# EAGLE board stream_i-o_2_2 (EAGLE 7.5.0), part 1 of 2
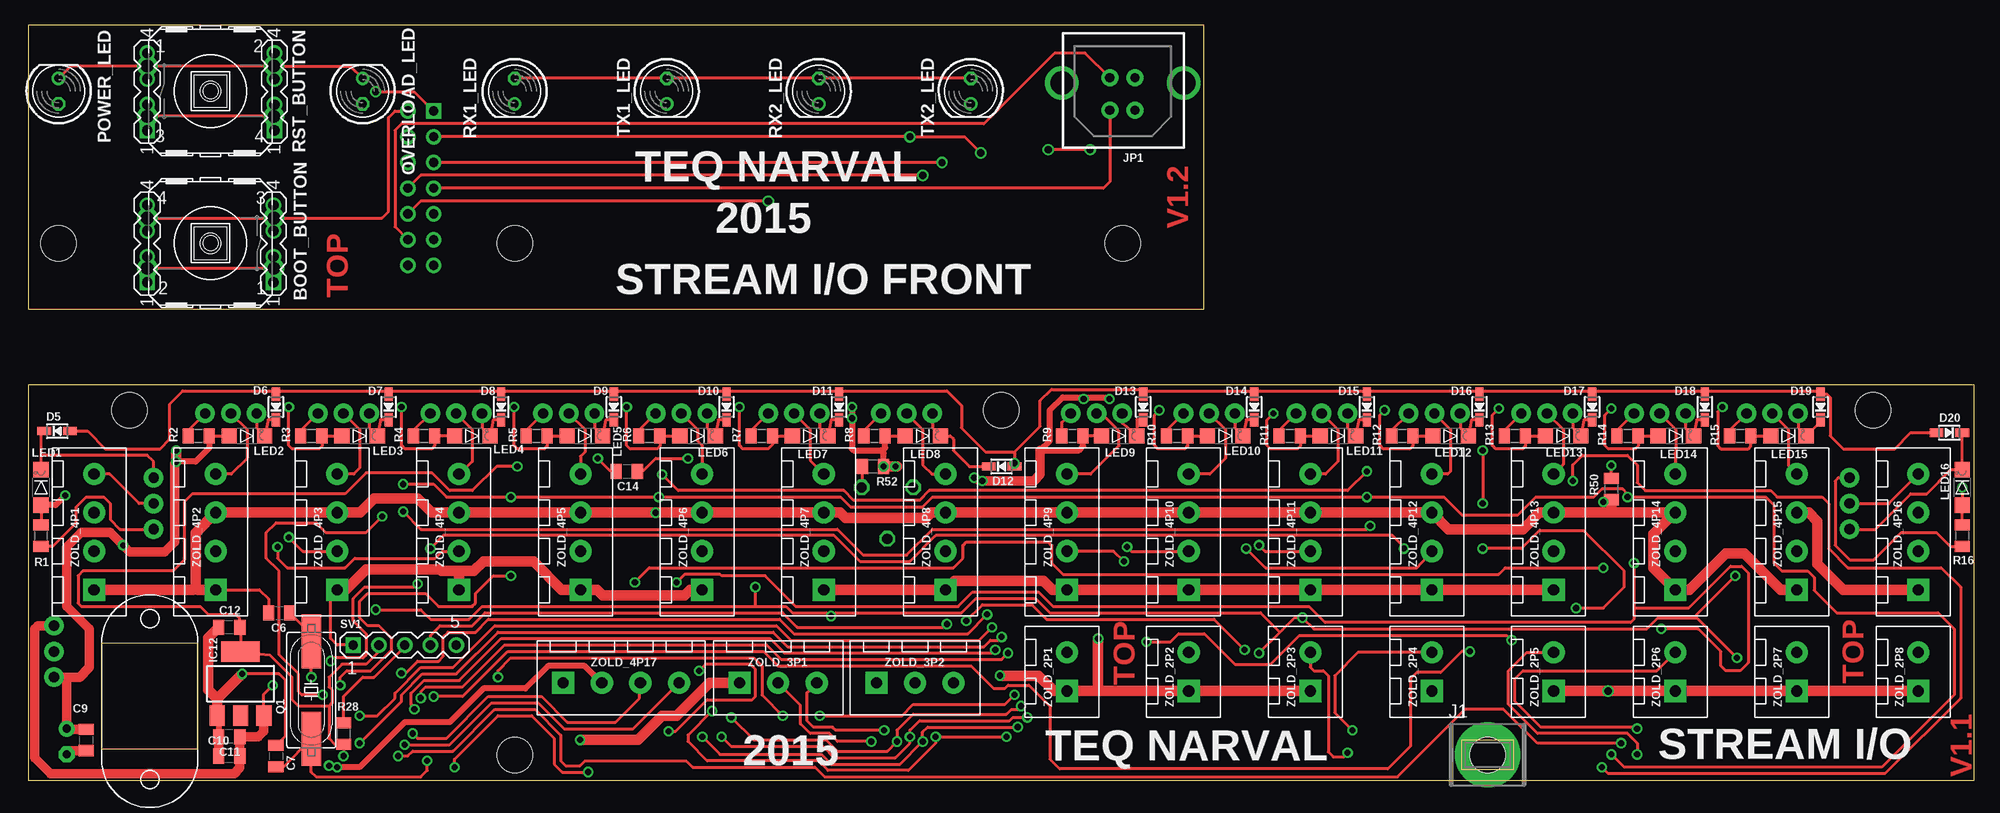
[diagram p3: board, top side]
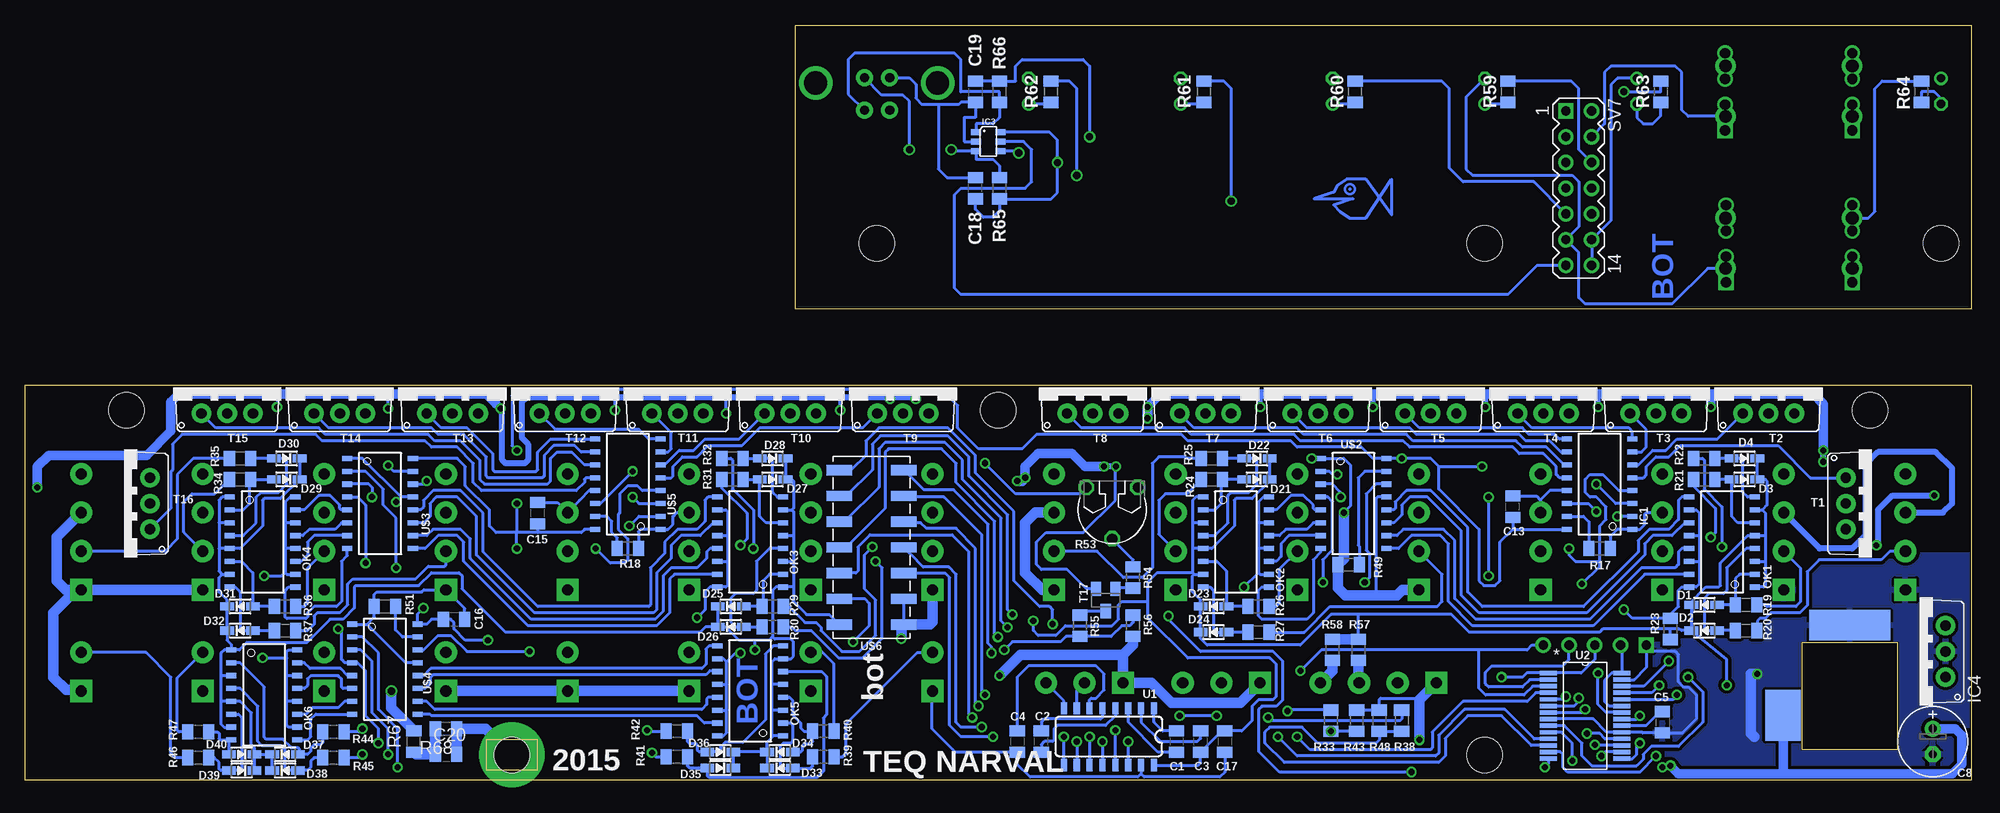
[diagram p4: board, bottom side, seen from below]

Size 192 x 74.5 mm. Coordinates in mm from the lower left corner, seen from the top.
Outline: 0,0 192,0 192,39 0,39 0,0
Outline: 0,46.5 116,46.5 116,74.5 0,74.5 0,46.5
Copper layers (1*16): Top 0.035mm / dielectric 1.5mm / Bottom 0.035mm
Design rules "10mil *": minimum track width 10mil, minimum drill 24mil, track to track 10mil, track to pad 10mil, pad to pad 10mil, via to via 10mil, smd to smd 10mil, copper to edge 5mil, drill to drill 5mil, minimum pad ring 10mil, minimum via ring 8mil, stop-mask expansion 4mil, vias tented up to drill 0mil, thermal gap 10mil
Net classes: 0 default: width 0.305 mm, clearance 0.305 mm
Holes 3.5 mm at 10,36.5 96,36.5 182,36.5 48,2.5 144,2.5 48,53 108,53 3,53

## Footprints (pad centres in the part's own frame; a part is rotated, then mirrored left to right if it is on the bottom)
RACON12 = drill 1.27 pad 2.032: 1 -6.248,2.489; 2 6.248,2.489; 3 -6.248,-2.489; 4 6.248,-2.489
C0805 = smd 1.1 x 1.5: 1 -1.05,0; 2 1.05,0
E2,5-7 = drill 0.813 pad 1.6: + -1.27,0 | drill 0.813 pad 1.6 octagon: - 1.27,0
SOD-323 = smd 1.35 x 0.8: A 1.27,0; C -1.27,0
DC_55/21 = smd 8 x 3 bottom: 1 0,6.985 | smd 3.5 x 5 bottom: 2 6.565,-1.905
SOP16 = smd 1 x 0.5: 1 -3.24,4.445; 2 -3.24,3.175; 3 -3.24,1.905; 4 -3.24,0.635; 5 -3.24,-0.635; 6 -3.24,-1.905; 7 -3.24,-3.175; 8 -3.24,-4.445; 9 3.24,-4.445; 10 3.24,-3.175; 11 3.24,-1.905; 12 3.24,-0.635; 13 3.24,0.635; 14 3.24,1.905; 15 3.24,3.175; 16 3.24,4.445
TSOP-6 = smd 0.6 x 1: 1 -0.95,-1.2; 2 0,-1.2; 3 0.95,-1.2; 4 0.95,1.2; 5 0,1.2; 6 -0.95,1.2
TO220V = drill 1.016 pad 1.93: 1 -2.54,-2.54; 2 0,-2.54; 3 2.54,-2.54
SOT223 = smd 1.5 x 2: 1 -2.3,-3.15; 2 0,-3.15; 3 2.3,-3.15 | smd 3.8 x 2: 4 0,3.15
62221 = drill 3.5 pad 6.452: 1 0,0
USB-B-PTH-VERTICAL = drill 0.914 pad 1.676: D+ -1.206,-1.321; D- -1.206,1.88; GND 1.283,-1.321; VBUS 1.283,1.88 | drill 2.286: P$1 -6.032,-0.813; P$2 6.007,-0.813
CHIPLED_1206 = smd 1.5 x 1.5: A 0,-1.75; C 0,1.75
MINI-FLAT-16 = smd 1 x 0.5: 1 -3.24,4.445; 2 -3.24,3.175; 3 -3.24,1.905; 4 -3.24,0.635; 5 -3.24,-0.635; 6 -3.24,-1.905; 7 -3.24,-3.175; 8 -3.24,-4.445; 9 3.24,-4.445; 10 3.24,-3.175; 11 3.24,-1.905; 12 3.24,-0.635; 13 3.24,0.635; 14 3.24,1.905; 15 3.24,3.175; 16 3.24,4.445
LED5MM = drill 0.813 octagon: A -1.27,0 | drill 0.813: K 1.27,0
HC49UP = smd 5.334 x 1.93: 1 -4.826,0; 2 4.826,0
R0805 = smd 1.1 x 1.5: 1 -1.05,0; 2 1.05,0
PT-6 = drill 1.016 octagon: A -2.54,-5.08; E 2.54,-5.08; S 0,0
MA05-1 = drill 0.914 pad 1.524 square: 1 -5.08,0 | drill 0.914 pad 1.524: 2 -2.54,0; 3 0,0; 4 2.54,0; 5 5.08,0
MA04-1 = drill 1.016 square: 1 -3.81,0 | drill 1.016: 2 -1.27,0; 3 1.27,0; 4 3.81,0
MA07-2 = drill 0.914 pad 1.524 square: 1 -7.62,-1.27 | drill 0.914 pad 1.524: 2 -7.62,1.27; 3 -5.08,-1.27; 4 -5.08,1.27; 5 -2.54,-1.27; 6 -2.54,1.27; 7 0,-1.27; 8 0,1.27; 9 2.54,-1.27; 10 2.54,1.27; 11 5.08,-1.27; 12 5.08,1.27; 13 7.62,-1.27; 14 7.62,1.27
SOT23-BEC = smd 1 x 1.4: B -0.95,-1.1; C 0,1.1; E 0.95,-1.1
SO016 = smd 0.6 x 1.2: 1 -4.445,-2.8; 2 -3.175,-2.8; 3 -1.905,-2.8; 4 -0.635,-2.8; 5 0.635,-2.8; 6 1.905,-2.8; 7 3.175,-2.8; 8 4.445,-2.8; 9 4.445,2.8; 10 3.175,2.8; 11 1.905,2.8; 12 0.635,2.8; 13 -0.635,2.8; 14 -1.905,2.8; 15 -3.175,2.8; 16 -4.445,2.8
SSOP28_MC = smd 1.676 x 0.432: 1 -3.617,4.225; 2 -3.617,3.575; 3 -3.617,2.925; 4 -3.617,2.275; 5 -3.617,1.625; 6 -3.617,0.975; 7 -3.617,0.325; 8 -3.617,-0.325; 9 -3.617,-0.975; 10 -3.617,-1.625; 11 -3.617,-2.275; 12 -3.617,-2.925; 13 -3.617,-3.575; 14 -3.617,-4.225; 15 3.617,-4.225; 16 3.617,-3.575; 17 3.617,-2.925; 18 3.617,-2.275; 19 3.617,-1.625; 20 3.617,-0.975; 21 3.617,-0.325; 22 3.617,0.325; 23 3.617,0.975; 24 3.617,1.625; 25 3.617,2.275; 26 3.617,2.925; 27 3.617,3.575; 28 3.617,4.225
PIN_HEADER_2X7 = smd 1.016 x 2.54: 1A -7.62,3.175; 1B -7.62,-3.175; 2A -5.08,3.175; 2B -5.08,-3.175; 3A -2.54,3.175; 3B -2.54,-3.175; 4A 0,3.175; 4B 0,-3.175; 5A 2.54,3.175; 5B 2.54,-3.175; 6A 5.08,3.175; 6B 5.08,-3.175; 7A 7.62,3.175; 7B 7.62,-3.175
ZOLD_KICSI_2P = drill 1.1 pad 2.184 square: 1 -1.905,-0.5 | drill 1.1 pad 2.184: 2 1.905,-0.5
ZOLD_KICSI_3P = drill 1.1 pad 2.184 square: 1 -3.81,-0.5 | drill 1.1 pad 2.184: 2 0,-0.5; 3 3.81,-0.5
ZOLD_KICSI_4P = drill 1.1 pad 2.184 square: 1 -5.715,-0.5 | drill 1.1 pad 2.184: 2 -1.905,-0.5; 3 1.905,-0.5; 4 5.715,-0.5

## Placement (x,y rotation side)
BOOT_BUTTON  BUTTONRACON12  [RACON12]  18,53 180 top
C1  1u  [C0805]  78.42,3.81 270 bottom
C2  1u  [C0805]  91.76,3.81 90 bottom
C3  1u  [C0805]  76.04,3.81 90 bottom
C4  1u  [C0805]  94.14,3.81 270 bottom
C5  10u  [C0805]  30.48,5.71 270 bottom
C6  22p  [C0805]  24.77,16.51 0 top
C7  22p  [C0805]  24.45,2.38 270 top
C8  220u  [E2,5-7]  3.81,3.81 270 bottom
C9  100n  [C0805]  5.71,3.97 270 top
C10  10u  [C0805]  19.84,2.38 180 top
C11  10u  [C0805]  19.84,4.29 180 top
C12  10u  [C0805]  19.84,15.08 180 top
C13  100n  [C0805]  45.24,26.99 90 bottom
C14  100n  [C0805]  59.05,30.48 0 top
C15  100n  [C0805]  141.45,26.35 90 bottom
C16  100n  [C0805]  149.7,15.88 0 bottom
C17  100n  [C0805]  73.66,3.81 270 bottom
C18  47p  [C0805]  98.27,58.42 90 bottom
C19  47p  [C0805]  98.27,67.94 270 bottom
C20  100n  [C0805]  150.5,2.54 0 bottom
D1  1N4148  [SOD-323]  26.35,17.3 0 bottom
D2  1N4148  [SOD-323]  26.35,14.76 0 bottom
D3  1N4148  [SOD-323]  22.38,29.69 180 bottom
D4  1N4148  [SOD-323]  22.38,31.75 180 bottom
D5  1N4148  [SOD-323]  2.86,34.45 0 top
D6  1N4148  [SOD-323]  24.45,36.83 90 top
D7  1N4148  [SOD-323]  35.56,36.83 90 top
D8  1N4148  [SOD-323]  46.67,36.83 90 top
D9  1N4148  [SOD-323]  57.78,36.83 90 top
D10  1N4148  [SOD-323]  68.9,36.83 90 top
D11  1N4148  [SOD-323]  80.01,36.83 90 top
D12  1N4148  [SOD-323]  96.04,30.96 0 top
D13  1N4148  [SOD-323]  110.01,36.83 90 top
D14  1N4148  [SOD-323]  120.97,36.83 90 top
D15  1N4148  [SOD-323]  132.08,36.83 90 top
D16  1N4148  [SOD-323]  143.19,36.83 90 top
D17  1N4148  [SOD-323]  154.31,36.83 90 top
D18  1N4148  [SOD-323]  165.42,36.83 90 top
D19  1N4148  [SOD-323]  176.85,36.83 90 top
D20  1N4148  [SOD-323]  189.55,34.29 180 top
D21  1N4148  [SOD-323]  70.48,29.69 180 bottom
D22  1N4148  [SOD-323]  70.48,31.75 180 bottom
D23  1N4148  [SOD-323]  74.77,17.14 0 bottom
D24  1N4148  [SOD-323]  74.77,14.61 0 bottom
D25  1N4148  [SOD-323]  122.4,17.14 0 bottom
D26  1N4148  [SOD-323]  122.4,15.12 0 bottom
D27  1N4148  [SOD-323]  118.27,29.69 180 bottom
D28  1N4148  [SOD-323]  118.27,31.75 180 bottom
D29  1N4148  [SOD-323]  166.21,29.69 180 bottom
D30  1N4148  [SOD-323]  166.21,31.75 180 bottom
D31  1N4148  [SOD-323]  170.81,17.14 0 bottom
D32  1N4148  [SOD-323]  170.81,14.76 0 bottom
D33  1N4148  [SOD-323]  117.55,1.19 0 bottom
D34  1N4148  [SOD-323]  117.55,2.78 0 bottom
D35  1N4148  [SOD-323]  123.43,1.19 180 bottom
D36  1N4148  [SOD-323]  123.43,2.78 180 bottom
D37  1N4148  [SOD-323]  166.37,2.54 0 bottom
D38  1N4148  [SOD-323]  166.37,0.95 0 bottom
D39  1N4148  [SOD-323]  170.66,0.95 180 bottom
D40  1N4148  [SOD-323]  170.66,2.54 180 bottom
DC1  DC_55/21  [DC_55/21]  12,8.3 0 top
IC1  SCT21SOP16  [SOP16]  36.67,29.21 180 bottom
IC3  BEM_VEDO  [TSOP-6]  97,63.02 270 bottom
IC4  7805TV  [TO220V]  5.08,12.7 90 bottom
IC12  LD117AS33TR  [SOT223]  20.95,9.53 0 top
J1  PIN1-2  [62221]  144,2.5 0 top
JP1  USBPTH-VERTICAL  [USB-B-PTH-VERTICAL]  108,68 180 top
LED1  RED  [CHIPLED_1206]  1.27,28.89 0 top
LED2  RED  [CHIPLED_1206]  21.59,33.97 270 top
LED3  RED  [CHIPLED_1206]  32.7,33.97 270 top
LED4  RED  [CHIPLED_1206]  43.81,33.97 270 top
LED5  RED  [CHIPLED_1206]  54.93,33.97 270 top
LED6  RED  [CHIPLED_1206]  66.04,33.97 270 top
LED7  RED  [CHIPLED_1206]  77.15,33.97 270 top
LED8  RED  [CHIPLED_1206]  88.27,33.97 270 top
LED9  RED  [CHIPLED_1206]  107.63,33.97 270 top
LED10  RED  [CHIPLED_1206]  118.11,33.97 270 top
LED11  RED  [CHIPLED_1206]  129.22,33.97 270 top
LED12  RED  [CHIPLED_1206]  140.34,33.97 270 top
LED13  RED  [CHIPLED_1206]  151.45,33.97 270 top
LED14  RED  [CHIPLED_1206]  162.56,33.97 270 top
LED15  RED  [CHIPLED_1206]  173.67,33.97 270 top
LED16  RED  [CHIPLED_1206]  190.82,28.89 0 top
OK1  TLP281-4  [MINI-FLAT-16]  24.61,23.5 180 bottom
OK2  TLP281-4  [MINI-FLAT-16]  72.55,23.5 0 bottom
OK3  TLP281-4  [MINI-FLAT-16]  120.49,23.5 180 bottom
OK4  TLP281-4  [MINI-FLAT-16]  168.59,23.5 0 bottom
OK5  TLP281-4  [MINI-FLAT-16]  120.49,8.81 180 bottom
OK6  TLP281-4  [MINI-FLAT-16]  168.43,8.41 0 bottom
OVERLOAD_LED  RED  [LED5MM]  33,68 90 top
POWER_LED  KEK  [LED5MM]  3,68 90 top
Q1  20MHz  [HC49UP]  27.94,8.89 90 top
R1  6R8  [R0805]  1.27,24.13 90 top
R2  6R8  [R0805]  16.83,33.97 0 top
R3  6R8  [R0805]  27.94,33.97 0 top
R4  6R8  [R0805]  39.05,33.97 0 top
R5  6R8  [R0805]  50.16,33.97 0 top
R6  6R8  [R0805]  61.28,33.97 0 top
R7  6R8  [R0805]  72.39,33.97 0 top
R8  6R8  [R0805]  83.5,33.97 0 top
R9  6R8  [R0805]  103.03,33.97 0 top
R10  6R8  [R0805]  113.35,33.97 0 top
R11  6R8  [R0805]  124.46,33.97 0 top
R12  6R8  [R0805]  135.57,33.97 0 top
R13  6R8  [R0805]  146.69,33.97 0 top
R14  6R8  [R0805]  157.8,33.97 0 top
R15  6R8  [R0805]  168.91,33.97 0 top
R16  6R8  [R0805]  190.82,24.13 90 top
R17  10k  [R0805]  36.67,22.86 180 bottom
R18  10k  [R0805]  132.56,22.86 180 bottom
R19  2k2  [R0805]  22.23,17.3 180 bottom
R20  2k2  [R0805]  22.23,14.76 180 bottom
R21  2k2  [R0805]  26.35,29.69 0 bottom
R22  2k2  [R0805]  26.35,31.75 0 bottom
R23  1k  [R0805]  29.69,14.92 270 bottom
R24  2k2  [R0805]  74.93,29.69 0 bottom
R25  2k2  [R0805]  74.93,31.75 0 bottom
R26  2k2  [R0805]  70.33,17.14 180 bottom
R27  2k2  [R0805]  70.33,14.61 180 bottom
R28  1k  [R0805]  31.11,4.6 270 top
R29  2k2  [R0805]  118.27,17.14 180 bottom
R30  2k2  [R0805]  118.27,15.12 180 bottom
R31  2k2  [R0805]  122.24,29.69 0 bottom
R32  2k2  [R0805]  122.24,31.75 0 bottom
R33  1k  [R0805]  63.18,5.87 90 bottom
R34  2k2  [R0805]  170.81,29.69 0 bottom
R35  2k2  [R0805]  170.81,31.75 0 bottom
R36  2k2  [R0805]  166.37,17.14 180 bottom
R37  2k2  [R0805]  166.37,14.76 180 bottom
R38  1k  [R0805]  56.2,5.87 90 bottom
R39  2k2  [R0805]  113.27,2.3 180 bottom
R40  2k2  [R0805]  113.27,4.84 180 bottom
R41  2k2  [R0805]  127.71,2.3 0 bottom
R42  2k2  [R0805]  127.71,4.84 0 bottom
R43  2k2  [R0805]  60.64,5.87 270 bottom
R44  2k2  [R0805]  161.61,4.76 180 bottom
R45  2k2  [R0805]  161.61,2.22 180 bottom
R46  2k2  [R0805]  174.94,2.22 0 bottom
R47  2k2  [R0805]  174.94,4.76 0 bottom
R48  2k2  [R0805]  58.42,5.87 270 bottom
R49  2k2  [R0805]  61.44,21.27 0 bottom
R50  2k2  [R0805]  156.21,28.73 90 top
R51  2k2  [R0805]  156.53,17.14 0 bottom
R52  4k7  [R0805]  83.34,30.96 0 top
R53  10k  [PT-6]  84.77,23.81 180 bottom
R54  10k  [R0805]  82.71,20 90 bottom
R55  10k  [R0805]  87.95,15.24 90 bottom
R56  3k3  [R0805]  82.71,15.24 90 bottom
R57  4k7  [R0805]  60.48,12.86 90 bottom
R58  4k7  [R0805]  63.02,12.86 90 bottom
R59  470  [R0805]  45.72,67.94 90 bottom
R60  2k2  [R0805]  60.8,67.94 90 bottom
R61  470  [R0805]  75.72,67.94 90 bottom
R62  2k2  [R0805]  90.81,67.94 90 bottom
R63  1k  [R0805]  30.64,67.94 90 bottom
R64  1k  [R0805]  4.92,67.94 90 bottom
R65  33  [R0805]  95.89,58.42 270 bottom
R66  33  [R0805]  95.89,67.94 90 bottom
R67  100  [R0805]  153.67,3.81 90 bottom
R68  10k  [R0805]  150.5,5.08 180 bottom
RST_BUTTON  BUTTONRACON12  [RACON12]  18,68 0 top
RX1_LED  ORANGE  [LED5MM]  48,68 270 top
RX2_LED  ORANGE  [LED5MM]  78,68 270 top
SV1  PROG  [MA05-1]  37.15,13.34 0 top
SV3  [MA04-1]  11.75,67.94 90 top
SV4  [MA04-1]  24.29,67.94 90 top
SV5  [MA04-1]  11.75,52.94 90 top
SV6  [MA04-1]  24.21,52.94 90 top
SV7  [MA07-2]  38.73,58.42 270 bottom
T1  BD242  [TO220V]  9.84,27.3 270 bottom
T2  BD242  [TO220V]  20,38.73 0 bottom
T3  BD242  [TO220V]  31.11,38.73 0 bottom
T4  BD242  [TO220V]  42.23,38.73 0 bottom
T5  BD242  [TO220V]  53.34,38.73 0 bottom
T6  BD242  [TO220V]  64.45,38.73 0 bottom
T7  BD242  [TO220V]  75.56,38.73 0 bottom
T8  BD242  [TO220V]  86.68,38.73 0 bottom
T9  BD242  [TO220V]  105.41,38.73 0 bottom
T10  BD242  [TO220V]  116.52,38.73 0 bottom
T11  BD242  [TO220V]  127.64,38.73 0 bottom
T12  BD242  [TO220V]  138.75,38.73 0 bottom
T13  BD242  [TO220V]  149.86,38.73 0 bottom
T14  BD242  [TO220V]  160.97,38.73 0 bottom
T15  BD242  [TO220V]  172.09,38.73 0 bottom
T16  BD242  [TO220V]  182.25,27.3 90 bottom
T17  BC858  [SOT23-BEC]  85.41,17.78 180 bottom
TX1_LED  GREEN  [LED5MM]  63,68 270 top
TX2_LED  GREEN  [LED5MM]  93,68 270 top
U1  MAX232SOIC16  [SO016]  85.09,4.29 180 bottom
U2  PIC32MX250F128B-I_SS  [SSOP28_MC]  38.1,6.35 0 bottom
U$2  SCT21SOP16  [SOP16]  60.96,27.3 0 bottom
U$3  SCT21SOP16  [SOP16]  157,27.3 0 bottom
U$4  SCT21SOP16  [SOP16]  156.53,10.95 0 bottom
U$5  SCT21SOP16  [SOP16]  132.56,29.21 180 bottom
U$6  PIN_HEADER_2X7  [PIN_HEADER_2X7]  108.51,22.97 270 bottom
ZOLD_2P1  ZOLD_KICSI_2P  [ZOLD_KICSI_2P]  102,10.7 90 top
ZOLD_2P2  ZOLD_KICSI_2P  [ZOLD_KICSI_2P]  114,10.7 90 top
ZOLD_2P3  ZOLD_KICSI_2P  [ZOLD_KICSI_2P]  126,10.7 90 top
ZOLD_2P4  ZOLD_KICSI_2P  [ZOLD_KICSI_2P]  138,10.7 90 top
ZOLD_2P5  ZOLD_KICSI_2P  [ZOLD_KICSI_2P]  150,10.7 90 top
ZOLD_2P6  ZOLD_KICSI_2P  [ZOLD_KICSI_2P]  162,10.7 90 top
ZOLD_2P7  ZOLD_KICSI_2P  [ZOLD_KICSI_2P]  174,10.7 90 top
ZOLD_2P8  ZOLD_KICSI_2P  [ZOLD_KICSI_2P]  186,10.7 90 top
ZOLD_3P1  ZOLD_KICSI_3P  [ZOLD_KICSI_3P]  74,10.1 0 top
ZOLD_3P2  ZOLD_KICSI_3P  [ZOLD_KICSI_3P]  87.5,10.1 0 top
ZOLD_4P1  ZOLD_KICSI_4P  [ZOLD_KICSI_4P]  6,24.5 90 top
ZOLD_4P2  ZOLD_KICSI_4P  [ZOLD_KICSI_4P]  18,24.5 90 top
ZOLD_4P3  ZOLD_KICSI_4P  [ZOLD_KICSI_4P]  30,24.5 90 top
ZOLD_4P4  ZOLD_KICSI_4P  [ZOLD_KICSI_4P]  42,24.5 90 top
ZOLD_4P5  ZOLD_KICSI_4P  [ZOLD_KICSI_4P]  54,24.5 90 top
ZOLD_4P6  ZOLD_KICSI_4P  [ZOLD_KICSI_4P]  66,24.5 90 top
ZOLD_4P7  ZOLD_KICSI_4P  [ZOLD_KICSI_4P]  78,24.5 90 top
ZOLD_4P8  ZOLD_KICSI_4P  [ZOLD_KICSI_4P]  90,24.5 90 top
ZOLD_4P9  ZOLD_KICSI_4P  [ZOLD_KICSI_4P]  102,24.5 90 top
ZOLD_4P10  ZOLD_KICSI_4P  [ZOLD_KICSI_4P]  114,24.5 90 top
ZOLD_4P11  ZOLD_KICSI_4P  [ZOLD_KICSI_4P]  126,24.5 90 top
ZOLD_4P12  ZOLD_KICSI_4P  [ZOLD_KICSI_4P]  138,24.5 90 top
ZOLD_4P13  ZOLD_KICSI_4P  [ZOLD_KICSI_4P]  150,24.5 90 top
ZOLD_4P14  ZOLD_KICSI_4P  [ZOLD_KICSI_4P]  162,24.5 90 top
ZOLD_4P15  ZOLD_KICSI_4P  [ZOLD_KICSI_4P]  174,24.5 90 top
ZOLD_4P16  ZOLD_KICSI_4P  [ZOLD_KICSI_4P]  186,24.5 90 top
ZOLD_4P17  ZOLD_KICSI_4P  [ZOLD_KICSI_4P]  58.5,10.1 0 top